# EAGLE design Rocket3RTC (EAGLE 9.3.2)
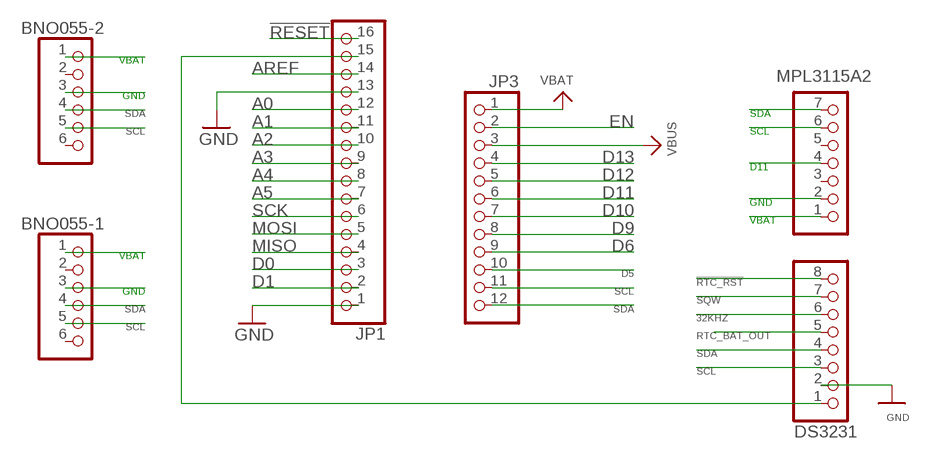
[diagram p0: schematic, sheet 1]

## Parts
BNO055-1  HEADER-1X670MIL  [1X06_ROUND_70]
BNO055-2  HEADER-1X670MIL  [1X06_ROUND_70]
DS3231  HEADER-1X870MIL  [1X08_ROUND_70]
JP1  HEADER-1X16ROUND  [1X16_ROUND]
JP3  HEADER-1X12  [1X12_ROUND]
MPL3115A2  HEADER-1X770MIL  [1X07_ROUND_70]

## Nets
32KHZ: DS3231.6
!RESET: JP1.16
!RTC_RST: DS3231.8
+3V3 [Supply]: DS3231.1 JP1.15
A0: JP1.12
A1: JP1.11
A2: JP1.10
A3: JP1.9
A4: JP1.8
A5: JP1.7
AREF: JP1.14
D0: JP1.3
D1: JP1.2
D5: JP3.10
D6: JP3.9
D9: JP3.8
D10: JP3.7
D11: JP3.6 MPL3115A2.4
D12: JP3.5
D13: JP3.4
EN: JP3.2
GND [Supply]: BNO055-1.3 BNO055-2.3 DS3231.2 JP1.1 JP1.13 MPL3115A2.2
MISO: JP1.4
MOSI: JP1.5
RTC_BAT_OUT: DS3231.5
SCK: JP1.6
SCL: BNO055-1.5 BNO055-2.5 DS3231.3 JP3.11 MPL3115A2.6
SDA: BNO055-1.4 BNO055-2.4 DS3231.4 JP3.12 MPL3115A2.7
SQW: DS3231.7
VBAT [Supply]: BNO055-1.1 BNO055-2.1 JP3.1 MPL3115A2.1
VBUS: JP3.3
Unconnected: BNO055-1.2 BNO055-1.6 BNO055-2.2 BNO055-2.6 MPL3115A2.3 MPL3115A2.5

## Library data of the parts
BNO055-1 BNO055-2 = microbuilder:HEADER-1X6: PIN HEADER
DS3231 = microbuilder:HEADER-1X8: PIN HEADER
JP1 = microbuilder:HEADER-1X16: PIN HEADER
JP3 = microbuilder:HEADER-1X12
MPL3115A2 = microbuilder:HEADER-1X7: PIN HEADER

## Net classes
0 default: width 0.254 mm, clearance 0.254 mm
1 Supply: width 0.381 mm, clearance 0.254 mm

## Board
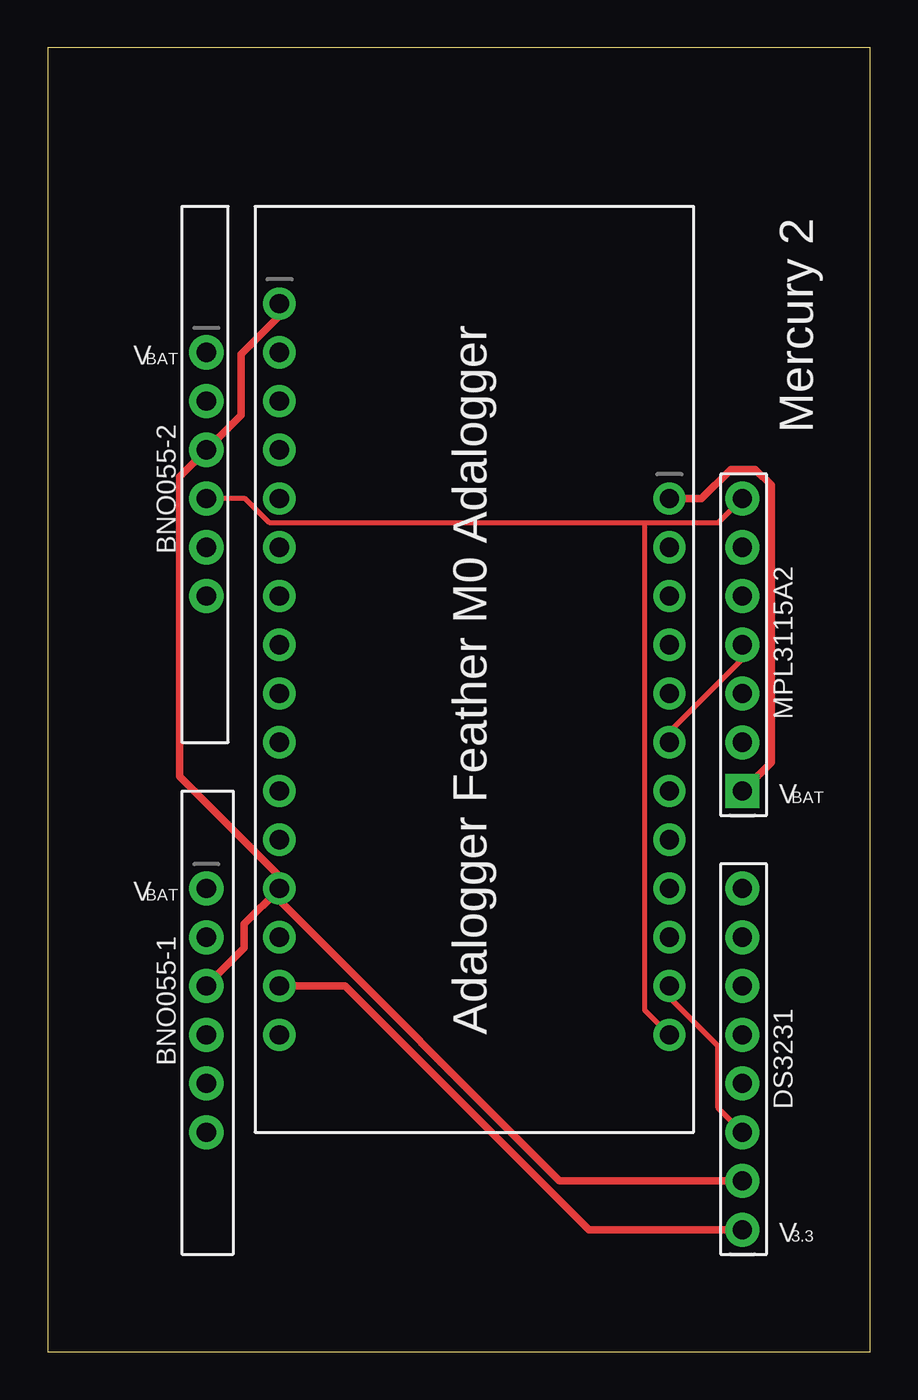
[diagram p1: board, top side]
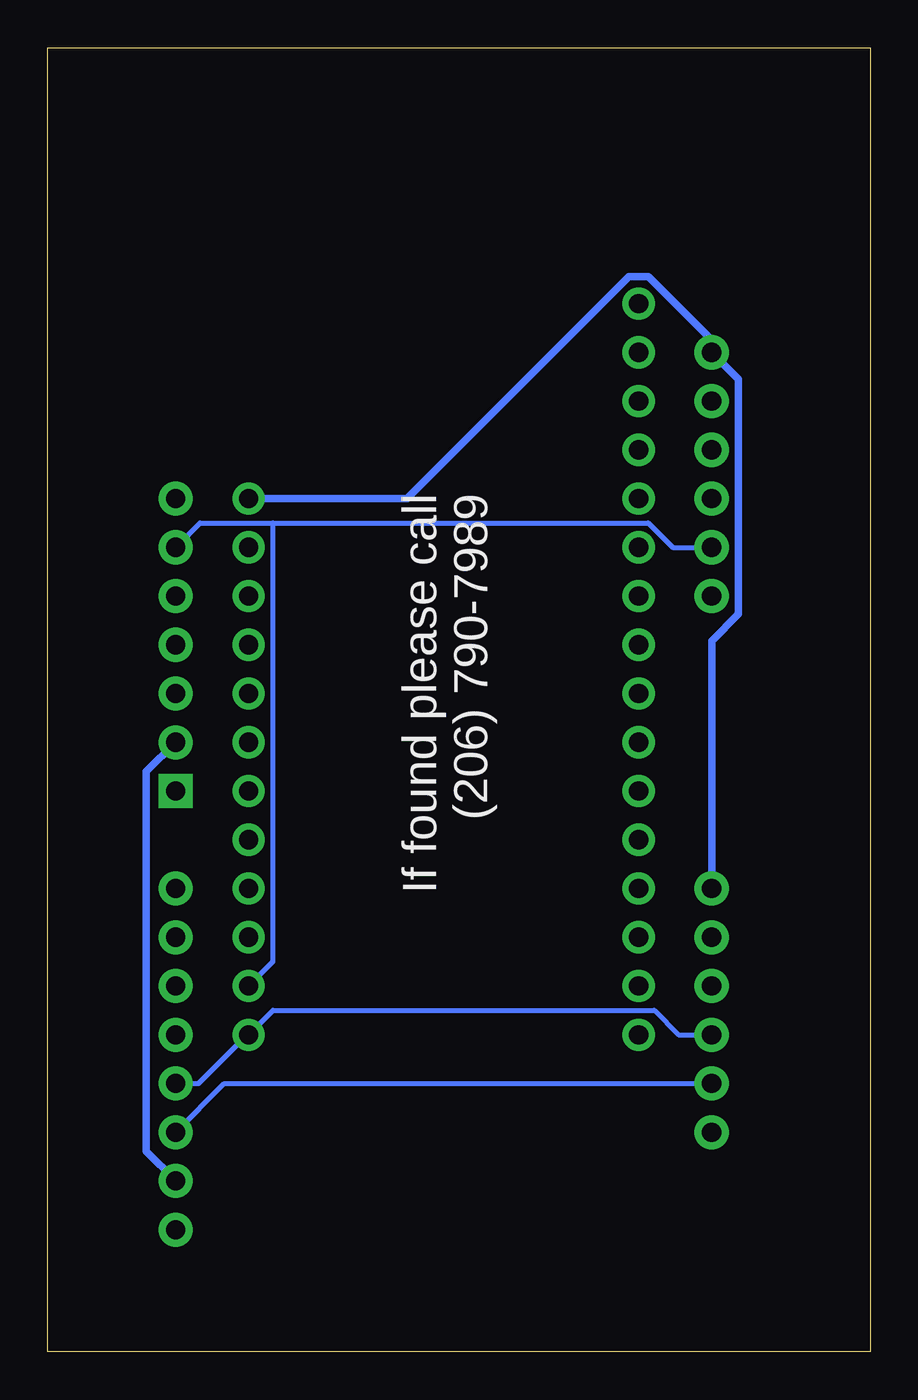
[diagram p2: board, bottom side, seen from below]

Size 42.85 x 67.94 mm. Coordinates in mm from the lower left corner, seen from the top.
Outline: 0,0 42.85,0 42.85,67.94 0,67.94 0,0
Copper layers (1*16): Top 0.035mm / dielectric 1.5mm / Bottom 0.035mm
Design rules "default": minimum track width 6mil, minimum drill 0.35mm, track to track 6mil, track to pad 6mil, pad to pad 6mil, via to via 6mil, smd to smd 6mil, copper to edge 40mil, drill to drill 6mil, minimum pad ring 10mil, minimum via ring 8mil, stop-mask expansion 4mil, vias tented up to drill 0mil, thermal gap 10mil

### Footprints (pad centres in the part's own frame; a part is rotated, then mirrored left to right if it is on the bottom)
1X06_ROUND_70 = drill 1 pad 1.778: 1 -6.35,0; 2 -3.81,0; 3 -1.27,0; 4 1.27,0; 5 3.81,0; 6 6.35,0
1X08_ROUND_70 = drill 1 pad 1.778: 1 -8.89,0; 2 -6.35,0; 3 -3.81,0; 4 -1.27,0; 5 1.27,0; 6 3.81,0; 7 6.35,0; 8 8.89,0
1X16_ROUND = drill 1 pad 1.676: 1 -19.05,0; 2 -16.51,0; 3 -13.97,0; 4 -11.43,0; 5 -8.89,0; 6 -6.35,0; 7 -3.81,0; 8 -1.27,0; 9 1.27,0; 10 3.81,0; 11 6.35,0; 12 8.89,0; 13 11.43,0; 14 13.97,0; 15 16.51,0; 16 19.05,0
1X12_ROUND = drill 1 pad 1.676: 1 -13.97,0; 2 -11.43,0; 3 -8.89,0; 4 -6.35,0; 5 -3.81,0; 6 -1.27,0; 7 1.27,0; 8 3.81,0; 9 6.35,0; 10 8.89,0; 11 11.43,0; 12 13.97,0
1X07_ROUND_70 = drill 1 pad 1.778 square: 1 -7.62,0 | drill 1 pad 1.778: 2 -5.08,0; 3 -2.54,0; 4 0,0; 5 2.54,0; 6 5.08,0; 7 7.62,0

### Placement (x,y rotation side)
BNO055-1  8.26,17.78 270 top
BNO055-2  8.26,45.72 270 top
DS3231  36.2,15.24 90 top
JP1  12.06,35.56 270 top
JP3  32.38,30.48 270 top
MPL3115A2  36.2,36.83 90 top

### Tracks (layer width: path | path; a pad name or v marks a point on that pad's centre or on a via)
+3V3
  Top 0.381: JP1.15 15.49,19.05 28.19,6.35 DS3231.1
D11
  Top 0.254: JP3.6 32.38,32.28 36.2,36.09 MPL3115A2.4
GND
  Top 0.381: JP1.13 12.06,24.11 10.24,22.28 10.24,21.03 BNO055-1.3 | JP1.1 12.06,53.98 10.06,51.97 10.06,48.79 BNO055-2.3 6.86,45.59 6.86,29.97 11.94,24.89 11.94,24.26 JP1.13 | DS3231.2 26.67,8.89 12.19,23.37 JP1.13
  Bottom 0.381: DS3231.2 36.2,8.91 37.72,10.44 37.72,30.23 MPL3115A2.2
SCL
  Top 0.254: JP3.11 32.38,18.47 34.92,15.93 34.92,12.7 DS3231.3
  Bottom 0.254: BNO055-2.5 10.29,41.91 11.56,43.18 31.11,43.18 | 31.11,43.18 34.92,43.18 MPL3115A2.6 | BNO055-1.5 33.66,13.97 DS3231.3 | 31.11,43.18 31.11,20.32 JP3.11
SDA
  Top 0.254: BNO055-2.4 10.29,44.45 11.56,43.18 31.11,43.18 | 31.11,43.18 34.92,43.18 MPL3115A2.7 | 31.11,43.18 31.11,17.78 JP3.12
  Bottom 0.254: DS3231.4 35,13.97 32.46,16.51 JP3.12 31.11,17.78 11.25,17.78 9.98,16.51 BNO055-1.4
VBAT
  Top 0.381: JP3.1 34.06,44.45 35.59,45.97 36.88,45.97 37.69,45.16 37.69,30.71 MPL3115A2.1
  Bottom 0.381: BNO055-1.1 8.26,37.03 6.86,38.43 6.86,50.67 BNO055-2.1 8.38,52.2 8.38,52.83 11.56,56.01 12.57,56.01 24.13,44.45 JP3.1

### Text on the board
tPlace: Mercury 2 | V | BAT | V | BAT | V | BAT | Adalogger Feather M0 Adalogger | V | 3.3
bPlace: If found please call / (206) 790-7989